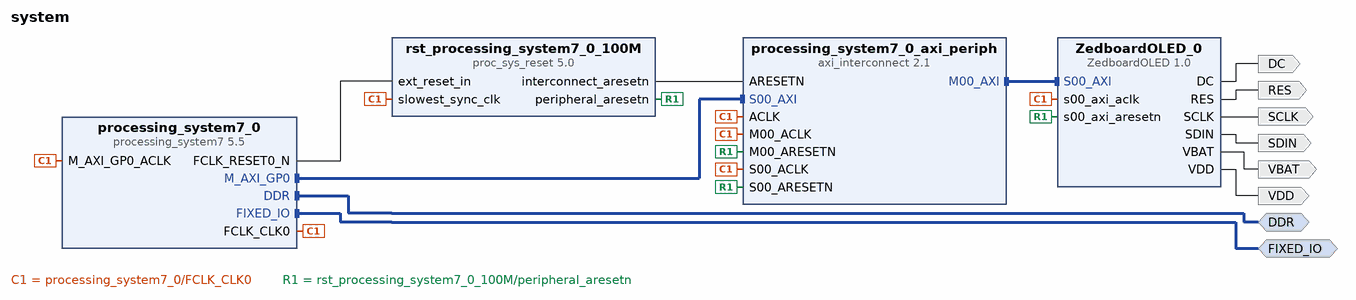
[diagram p0: block diagram of the top level]
# Vivado block design system, Vivado 2015.4
create_bd_design system

create_bd_intf_port -mode Master -vlnv xilinx.com:interface:ddrx_rtl:1.0 DDR
create_bd_intf_port -mode Master -vlnv xilinx.com:display_processing_system7:fixedio_rtl:1.0 FIXED_IO
create_bd_port -dir O SDIN
create_bd_port -dir O SCLK
create_bd_port -dir O DC
create_bd_port -dir O RES
create_bd_port -dir O VBAT
create_bd_port -dir O VDD

create_bd_cell -type ip -vlnv xilinx.com:ip:processing_system7:5.5 processing_system7_0
set_property -dict {CONFIG.preset ZedBoard} [get_bd_cells processing_system7_0]
create_bd_cell -type ip -vlnv tamu.edu:user:ZedboardOLED:1.0 ZedboardOLED_0
create_bd_cell -type ip -vlnv xilinx.com:ip:axi_interconnect:2.1 processing_system7_0_axi_periph
set_property -dict {CONFIG.NUM_MI 1} [get_bd_cells processing_system7_0_axi_periph]
create_bd_cell -type ip -vlnv xilinx.com:ip:proc_sys_reset:5.0 rst_processing_system7_0_100M

# ---- connections ----

connect_bd_intf_net [get_bd_intf_pins processing_system7_0/M_AXI_GP0] [get_bd_intf_pins processing_system7_0_axi_periph/S00_AXI]
connect_bd_intf_net [get_bd_intf_pins processing_system7_0_axi_periph/M00_AXI] [get_bd_intf_pins ZedboardOLED_0/S00_AXI]
connect_bd_intf_net [get_bd_intf_ports DDR] [get_bd_intf_pins processing_system7_0/DDR]
connect_bd_intf_net [get_bd_intf_ports FIXED_IO] [get_bd_intf_pins processing_system7_0/FIXED_IO]
connect_bd_net [get_bd_pins processing_system7_0/FCLK_CLK0] \
  [get_bd_pins processing_system7_0/M_AXI_GP0_ACLK] [get_bd_pins processing_system7_0_axi_periph/S00_ACLK] \
  [get_bd_pins rst_processing_system7_0_100M/slowest_sync_clk] [get_bd_pins processing_system7_0_axi_periph/ACLK] \
  [get_bd_pins ZedboardOLED_0/s00_axi_aclk] [get_bd_pins processing_system7_0_axi_periph/M00_ACLK]
connect_bd_net [get_bd_pins processing_system7_0/FCLK_RESET0_N] [get_bd_pins rst_processing_system7_0_100M/ext_reset_in]
connect_bd_net [get_bd_pins rst_processing_system7_0_100M/peripheral_aresetn] \
  [get_bd_pins processing_system7_0_axi_periph/S00_ARESETN] [get_bd_pins ZedboardOLED_0/s00_axi_aresetn] \
  [get_bd_pins processing_system7_0_axi_periph/M00_ARESETN]
connect_bd_net [get_bd_pins rst_processing_system7_0_100M/interconnect_aresetn] [get_bd_pins processing_system7_0_axi_periph/ARESETN]
connect_bd_net [get_bd_pins ZedboardOLED_0/SDIN] [get_bd_ports SDIN]
connect_bd_net [get_bd_pins ZedboardOLED_0/SCLK] [get_bd_ports SCLK]
connect_bd_net [get_bd_pins ZedboardOLED_0/DC] [get_bd_ports DC]
connect_bd_net [get_bd_pins ZedboardOLED_0/RES] [get_bd_ports RES]
connect_bd_net [get_bd_pins ZedboardOLED_0/VBAT] [get_bd_ports VBAT]
connect_bd_net [get_bd_pins ZedboardOLED_0/VDD] [get_bd_ports VDD]

# ---- address map ----
assign_bd_address -offset 0x43C00000 -range 64K -target_address_space [get_bd_addr_spaces processing_system7_0/Data] [get_bd_addr_segs ZedboardOLED_0/S00_AXI/S00_AXI_reg]

validate_bd_design
save_bd_design
